# Altium schematic sheet 12_B_TO_B.SchDoc
size A3
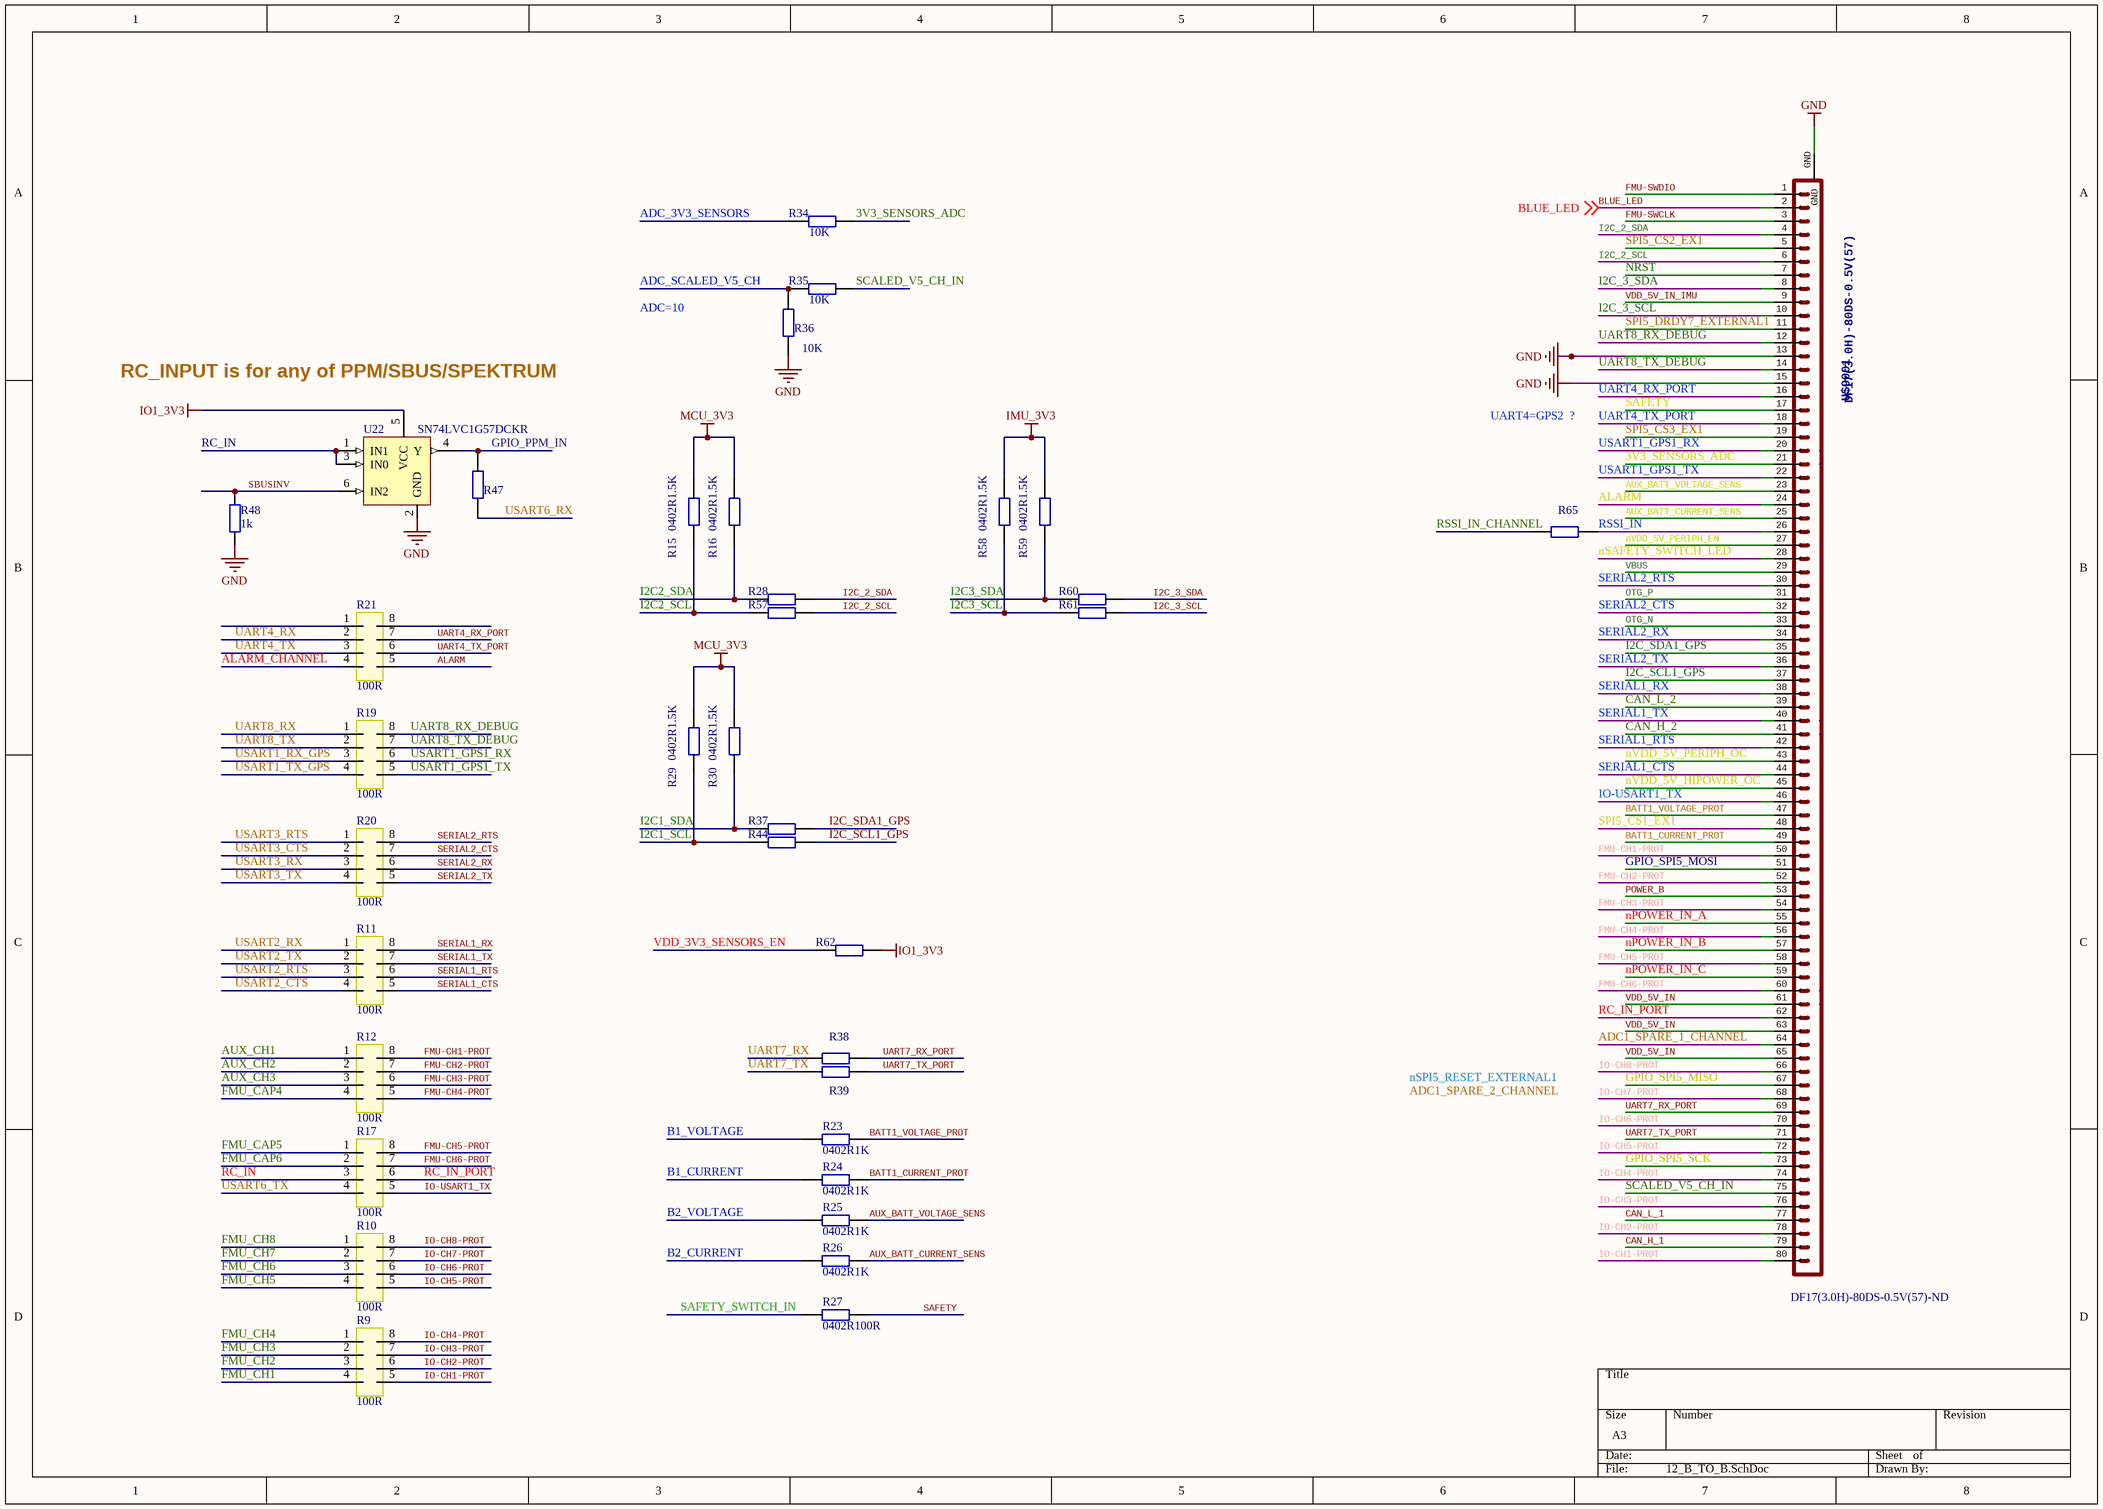
[diagram p0: 12_B_TO_B.SchDoc]

## Parts
R9  100R  [0402_4r]
R10  100R  [0402_4r]
R11  100R  [0402_4r]
R12  100R  [0402_4r]
R15  0402R1.5K  [0402R]
R16  0402R1.5K  [0402R]
R17  100R  [0402_4r]
R19  100R  [0402_4r]
R20  100R  [0402_4r]
R21  100R  [0402_4r]
R23  0402R1K  [0402R]
R24  0402R1K  [0402R]
R25  0402R1K  [0402R]
R26  0402R1K  [0402R]
R27  0402R100R  [0402R]
R28  0402R100R  [0402R]  (value not drawn)
R29  0402R1.5K  [0402R]
R30  0402R1.5K  [0402R]
R34  10K  [0402R]
R35  10K  [0402R]
R36  10K  [0402R]
R37  0402R100R  [0402R]  (value not drawn)
R38  0402R100R  [0402R]  (value not drawn)
R39  0402R100R  [0402R]  (value not drawn)
R44  0402R100R  [0402R]  (value not drawn)
R47  100R  [0402R]  (value not drawn)
R48  1k  [R0402]
R57  0402R100R  [0402R]  (value not drawn)
R58  0402R1.5K  [0402R]
R59  0402R1.5K  [0402R]
R60  0402R100R  [0402R]  (value not drawn)
R61  0402R100R  [0402R]  (value not drawn)
R62  10K/NC  [0402R]  (value not drawn)
R65  0402R100R  [0402R]  (value not drawn)
U22  SN74LVC1G57DCKR  [sot323-6]
U$9001  DF17(3.0H)-80DS-0.5V(57)  Supplier Part Number 1: DF17(3.0H)-80DS-0.5V(57)-ND  [DF17(3.0H)-80DS-0.5V(57)]

## Nets
GND: R36.1 R48.1 U22.2(GND) U$9001.13 U$9001.15 U$9001.GND
IMU_3V3: R58.2 R59.2
IO1_3V3: R62.2 U22.5(VCC)
MCU_3V3: R15.2 R16.2 R29.2 R30.2
3V3_SENSORS_ADC: R34.2 U$9001.21
ADC1_SPARE_1_CHANNEL: U$9001.64
ADC_3V3_SENSORS: R34.1
ADC_SCALED_V5_CH: R35.1 R36.2
ALARM: R21.5 U$9001.24
ALARM_CHANNEL: R21.4
AUX_BATT_CURRENT_SENS: R26.2 U$9001.25
AUX_BATT_VOLTAGE_SENS: R25.2 U$9001.23
AUX_CH1: R12.1
AUX_CH2: R12.2
AUX_CH3: R12.3
B1_CURRENT: R24.1
B1_VOLTAGE: R23.1
B2_CURRENT: R26.1
B2_VOLTAGE: R25.1
BATT1_CURRENT_PROT: R24.2 U$9001.49
BATT1_VOLTAGE_PROT: R23.2 U$9001.47
BLUE_LED: U$9001.2 ; off-sheet BLUE_LED
CAN_H_1: U$9001.79
CAN_H_2: U$9001.41
CAN_L_1: U$9001.77
CAN_L_2: U$9001.39
FMU-CH1-PROT: R12.8 U$9001.50
FMU-CH2-PROT: R12.7 U$9001.52
FMU-CH3-PROT: R12.6 U$9001.54
FMU-CH4-PROT: R12.5 U$9001.56
FMU-CH5-PROT: R17.8 U$9001.58
FMU-CH6-PROT: R17.7 U$9001.60
FMU-SWCLK: U$9001.3
FMU-SWDIO: U$9001.1
FMU_CAP4: R12.4
FMU_CAP5: R17.1
FMU_CAP6: R17.2
FMU_CH1: R9.4
FMU_CH2: R9.3
FMU_CH3: R9.2
FMU_CH4: R9.1
FMU_CH5: R10.4
FMU_CH6: R10.3
FMU_CH7: R10.2
FMU_CH8: R10.1
GPIO_PPM_IN: R47.2 U22.4(Y)
GPIO_SPI5_MISO: U$9001.67
GPIO_SPI5_MOSI: U$9001.51
GPIO_SPI5_SCK: U$9001.73
I2C1_SCL: R29.1 R44.1
I2C1_SDA: R30.1 R37.1
I2C2_SCL: R15.1 R57.1
I2C2_SDA: R16.1 R28.1
I2C3_SCL: R58.1 R61.1
I2C3_SDA: R59.1 R60.1
I2C_2_SCL: R57.2 U$9001.6
I2C_2_SDA: R28.2 U$9001.4
I2C_3_SCL: R61.2 U$9001.10
I2C_3_SDA: R60.2 U$9001.8
I2C_SCL1_GPS: R44.2 U$9001.37
I2C_SDA1_GPS: R37.2 U$9001.35
IO-CH1-PROT: R9.5 U$9001.80
IO-CH2-PROT: R9.6 U$9001.78
IO-CH3-PROT: R9.7 U$9001.76
IO-CH4-PROT: R9.8 U$9001.74
IO-CH5-PROT: R10.5 U$9001.72
IO-CH6-PROT: R10.6 U$9001.70
IO-CH7-PROT: R10.7 U$9001.68
IO-CH8-PROT: R10.8 U$9001.66
IO-USART1_TX: R17.5 U$9001.46
nPOWER_IN_A: U$9001.55
nPOWER_IN_B: U$9001.57
nPOWER_IN_C: U$9001.59
NRST: U$9001.7
nSAFETY_SWITCH_LED: U$9001.28
nVDD_5V_HIPOWER_OC: U$9001.45
nVDD_5V_PERIPH_EN: U$9001.27
nVDD_5V_PERIPH_OC: U$9001.43
OTG_N: U$9001.33
OTG_P: U$9001.31
POWER_B: U$9001.53
RC_IN: R17.3 U22.1(IN1) U22.3(IN0)
RC_IN_PORT: R17.6 U$9001.62
RSSI_IN: R65.2 U$9001.26
RSSI_IN_CHANNEL: R65.1
SAFETY: R27.2 U$9001.17
SAFETY_SWITCH_IN: R27.1
SBUSINV: R48.2 U22.6(IN2)
SCALED_V5_CH_IN: R35.2 U$9001.75
SERIAL1_CTS: R11.5 U$9001.44
SERIAL1_RTS: R11.6 U$9001.42
SERIAL1_RX: R11.8 U$9001.38
SERIAL1_TX: R11.7 U$9001.40
SERIAL2_CTS: R20.7 U$9001.32
SERIAL2_RTS: R20.8 U$9001.30
SERIAL2_RX: R20.6 U$9001.34
SERIAL2_TX: R20.5 U$9001.36
SPI5_CS1_EX1: U$9001.48
SPI5_CS2_EX1: U$9001.5
SPI5_CS3_EX1: U$9001.19
SPI5_DRDY7_EXTERNAL1: U$9001.11
UART4_RX: R21.2
UART4_RX_PORT: R21.7 U$9001.16
UART4_TX: R21.3
UART4_TX_PORT: R21.6 U$9001.18
UART7_RX: R38.1
UART7_RX_PORT: R38.2 U$9001.69
UART7_TX: R39.1
UART7_TX_PORT: R39.2 U$9001.71
UART8_RX: R19.1
UART8_RX_DEBUG: R19.8 U$9001.12
UART8_TX: R19.2
UART8_TX_DEBUG: R19.7 U$9001.14
USART1_GPS1_RX: R19.6 U$9001.20
USART1_GPS1_TX: R19.5 U$9001.22
USART1_RX_GPS: R19.3
USART1_TX_GPS: R19.4
USART2_CTS: R11.4
USART2_RTS: R11.3
USART2_RX: R11.1
USART2_TX: R11.2
USART3_CTS: R20.2
USART3_RTS: R20.1
USART3_RX: R20.3
USART3_TX: R20.4
USART6_RX: R47.1
USART6_TX: R17.4
VBUS: U$9001.29
VDD_3V3_SENSORS_EN: R62.1
VDD_5V_IN: U$9001.61 U$9001.63 U$9001.65
VDD_5V_IN_IMU: U$9001.9

Not connected (* = marked no-connect by the designer): R21 1 8

## Notes on the sheet
- RC_INPUT is for any of PPM/SBUS/SPEKTRUM
- Labels drawn without touching a wire or pin: ADC1_SPARE_2_CHANNEL, ADC=10, nSPI5_RESET_EXTERNAL1, UART4=GPS2  ?

## Library data of the parts
R9-R12 R17 R19-R21 = 0402-8R-4R
R15 R16 R29 R30 R58 R59 = 0402R10K: 0402R10K 1%
R23-R28 R34-R39 R44 R47 R57 R60-R62 R65 = 0402R100R: 0402R100R 1%
R48 = Res2: Resistor; Published: 8-Jun-2000; LatestRevisionDate: 17-Jul-2002; LatestRevisionNote: Re-released for DXP Platform.; PackageReference: AXIAL-0.4; Publisher: Altium Limited; PackageDescription: Axial Device, Thru-Hole; 2 Leads; 0.4 in Pin Spacing; Value: 1K
U22 = 74LVC1G57
U$9001 = CON-DF17-80F